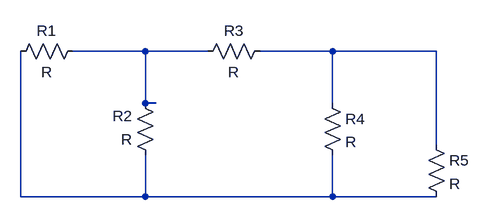
[diagram p0: schematic 1.asc]
1.asc, the LTspice schematic file:
Version 4
SHEET 1 880 680
WIRE 288 16 176 16
WIRE 384 16 288 16
WIRE 576 16 464 16
WIRE 736 16 576 16
WIRE 288 96 288 16
WIRE 304 96 288 96
WIRE 576 96 576 16
WIRE 736 160 736 16
WIRE 96 240 96 16
WIRE 288 240 288 176
WIRE 288 240 96 240
WIRE 576 240 576 176
WIRE 576 240 288 240
WIRE 736 240 576 240
SYMBOL res 192 0 R90
WINDOW 0 0 56 VBottom 2
WINDOW 3 32 56 VTop 2
SYMATTR InstName R1
SYMBOL res 304 192 R180
WINDOW 0 36 76 Left 2
WINDOW 3 36 40 Left 2
SYMATTR InstName R2
SYMBOL res 368 32 R270
WINDOW 0 32 56 VTop 2
WINDOW 3 0 56 VBottom 2
SYMATTR InstName R3
SYMBOL res 560 80 R0
SYMATTR InstName R4
SYMBOL res 720 144 R0
SYMATTR InstName R5

The netlist it stands for:
* 1.asc
R1 N001 N003 R
R2 N003 N001 R
R3 N001 N002 R
R4 N002 N003 R
R5 N002 N003 R
.backanno
.end